# Altium schematic sheet Sheet3.SchDoc
size A; SheetNumber: 1; SheetTotal: 1
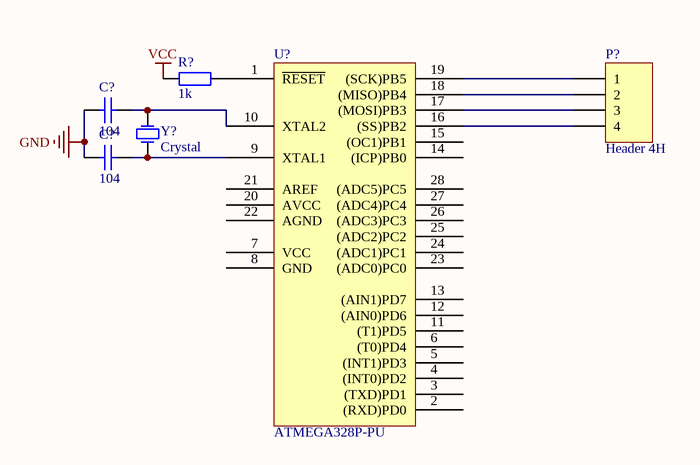
[diagram p0: Sheet3.SchDoc]

## Parts
(Parts that share a designator on the sheet are numbered #1, #2 ... from top to bottom, then left to right.)
C?#1  104  [Tu gom]
C?#2  104  [Tu gom]
P?  Header 4H  [HDR1X4]
R?  1k  [RESISTOR]
U?  ATMEGA328P-PU  [DIP28]
Y?  Crystal  [CRYSTAL DIP]

## Nets
GND: C?#1.1 C?#2.1
VCC: R?.1
NetC?#1_2: C?#1.2 U?.10(XTAL2) Y?.2(OSC2)
NetC?#2_2: C?#2.2 U?.9(XTAL1) Y?.1(OSC1)
NetP?_1: P?.1 U?.19((SCK)PB5)
NetP?_2: P?.2 U?.18((MISO)PB4)
NetP?_3: P?.3 U?.17((MOSI)PB3)
NetP?_4: P?.4 U?.16((SS)PB2)
NetR?_2: R?.2 U?.1(~{RESET})

Not connected (* = marked no-connect by the designer): U? 2((RXD)PD0) 3((TXD)PD1) 4((INT0)PD2) 5((INT1)PD3) 6((T0)PD4) 7(VCC) 8(GND) 11((T1)PD5) 12((AIN0)PD6) 13((AIN1)PD7) 14((ICP)PB0) 15((OC1)PB1) 20(AVCC) 21(AREF) 22(AGND) 23((ADC0)PC0) 24((ADC1)PC1) 25((ADC2)PC2) 26((ADC3)PC3) 27((ADC4)PC4) 28((ADC5)PC5)

## Library data of the parts
C?#1 C?#2 = CAP CERAMIC: Published: 8-Jun-2000; LatestRevisionDate: 17-Jul-2002; LatestRevisionNote: Re-released for DXP Platform.; PackageReference: RAD-0.3; Publisher: Altium Limited
R? = RESISTOR: Value: R1/4W - 1K
P? = Header 4H: LatestRevisionDate: 17-Jul-2002; LatestRevisionNote: Re-released for DXP Platform.; Publisher: Altium Limited
Y? = Crystal: Published: 8-Jun-2000; LatestRevisionDate: 17-Jul-2002; LatestRevisionNote: Re-released for DXP Platform.; PackageReference: R38; Publisher: Altium Limited